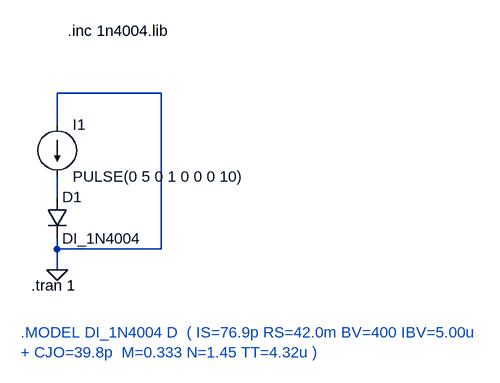
[diagram p0: schematic EP4.asc]
EP4.asc, the LTspice schematic file:
Version 4.1
SHEET 1 1316 680
WIRE 288 32 128 32
WIRE 128 80 128 32
WIRE 128 192 128 160
WIRE 128 272 128 256
WIRE 288 272 288 32
WIRE 288 272 128 272
WIRE 128 304 128 272
FLAG 128 304 0
SYMBOL current 128 80 R0
WINDOW 123 0 0 Left 0
WINDOW 39 0 0 Left 0
SYMATTR InstName I1
SYMATTR Value PULSE(0 5 0 1 0 0 0 10)
SYMBOL diode 112 192 R0
SYMATTR InstName D1
SYMATTR Value DI_1N4004
TEXT 72 400 Left 2 ;.MODEL DI_1N4004 D  ( IS=76.9p RS=42.0m BV=400 IBV=5.00u\n+ CJO=39.8p  M=0.333 N=1.45 TT=4.32u )
TEXT 88 328 Left 2 !.tran 1
TEXT 144 -64 Left 2 !.inc 1n4004.lib

The netlist it stands for:
* EP4.asc
I1 0 N001 PULSE(0 5 0 1 0 0 0 10)
D1 N001 0 DI_1N4004
.model D D
.lib standard.dio
* .MODEL DI_1N4004 D  ( IS=76.9p RS=42.0m BV=400 IBV=5.00u
* + CJO=39.8p  M=0.333 N=1.45 TT=4.32u )
.tran 1
.inc 1n4004.lib
.backanno
.end